# EasyEDA Pro project ProPrj_MambaQuad_2026-02-09.epro, board RC V1
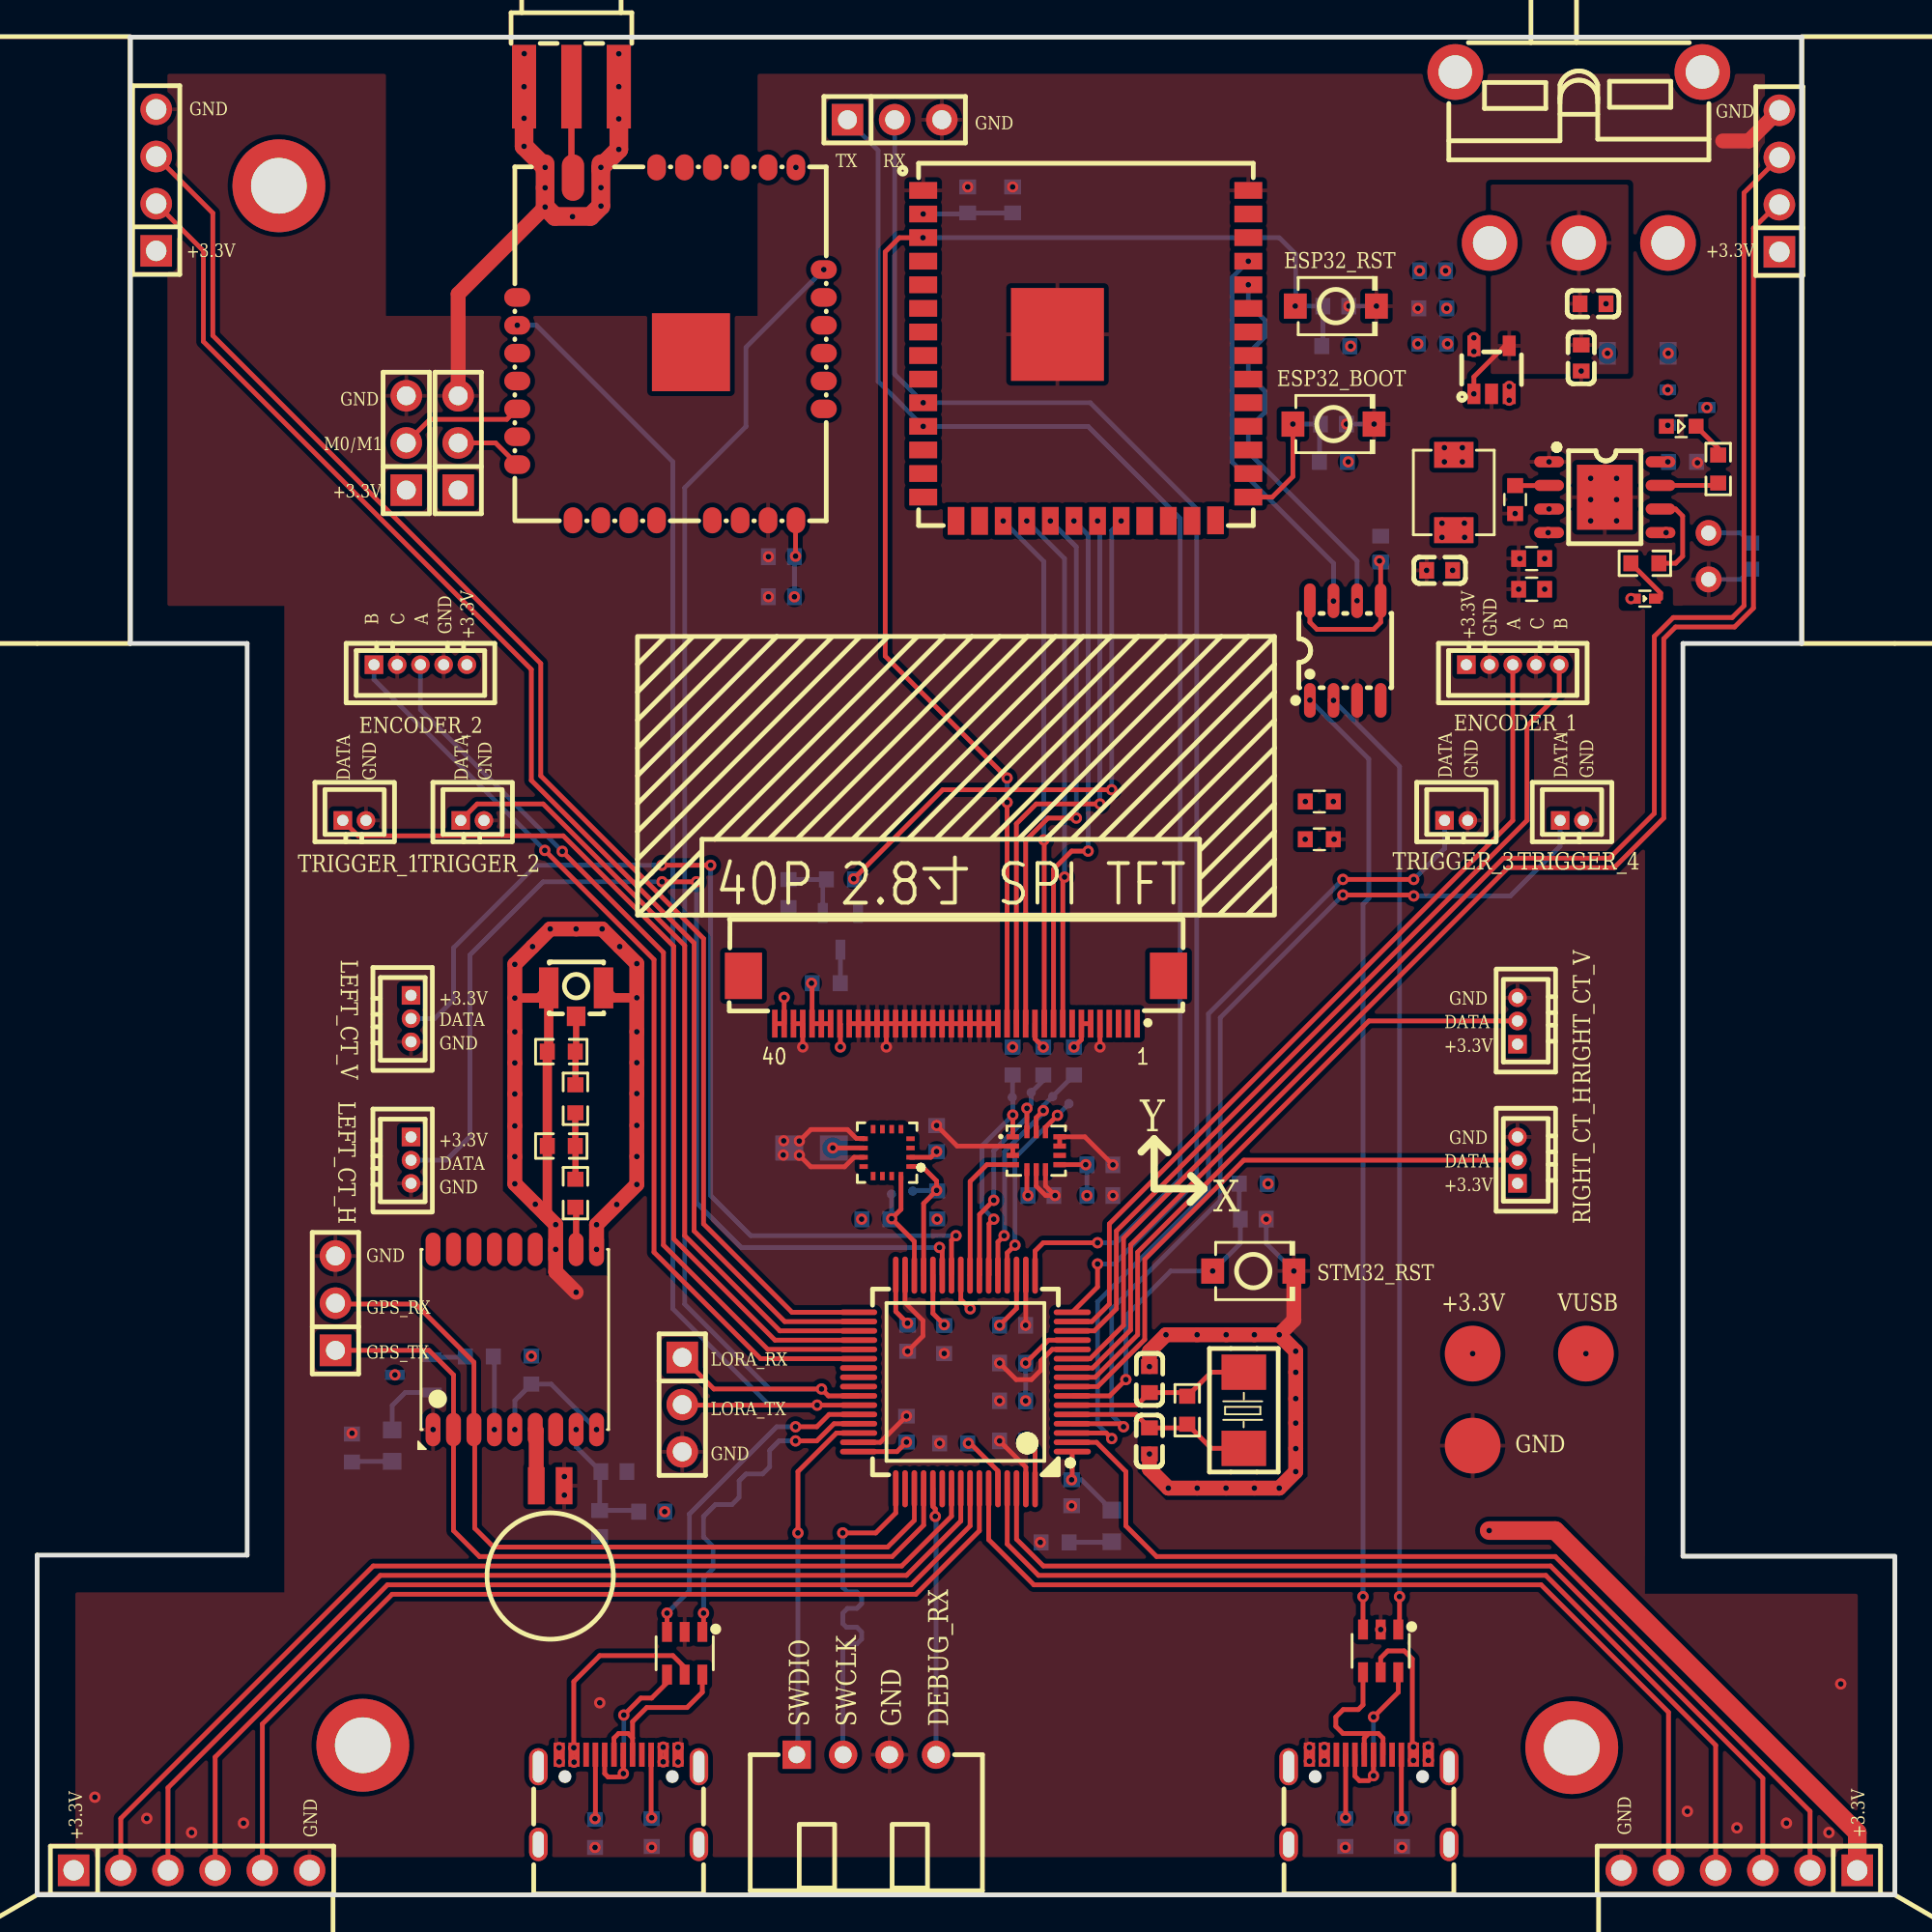
[diagram p10: board, top side]
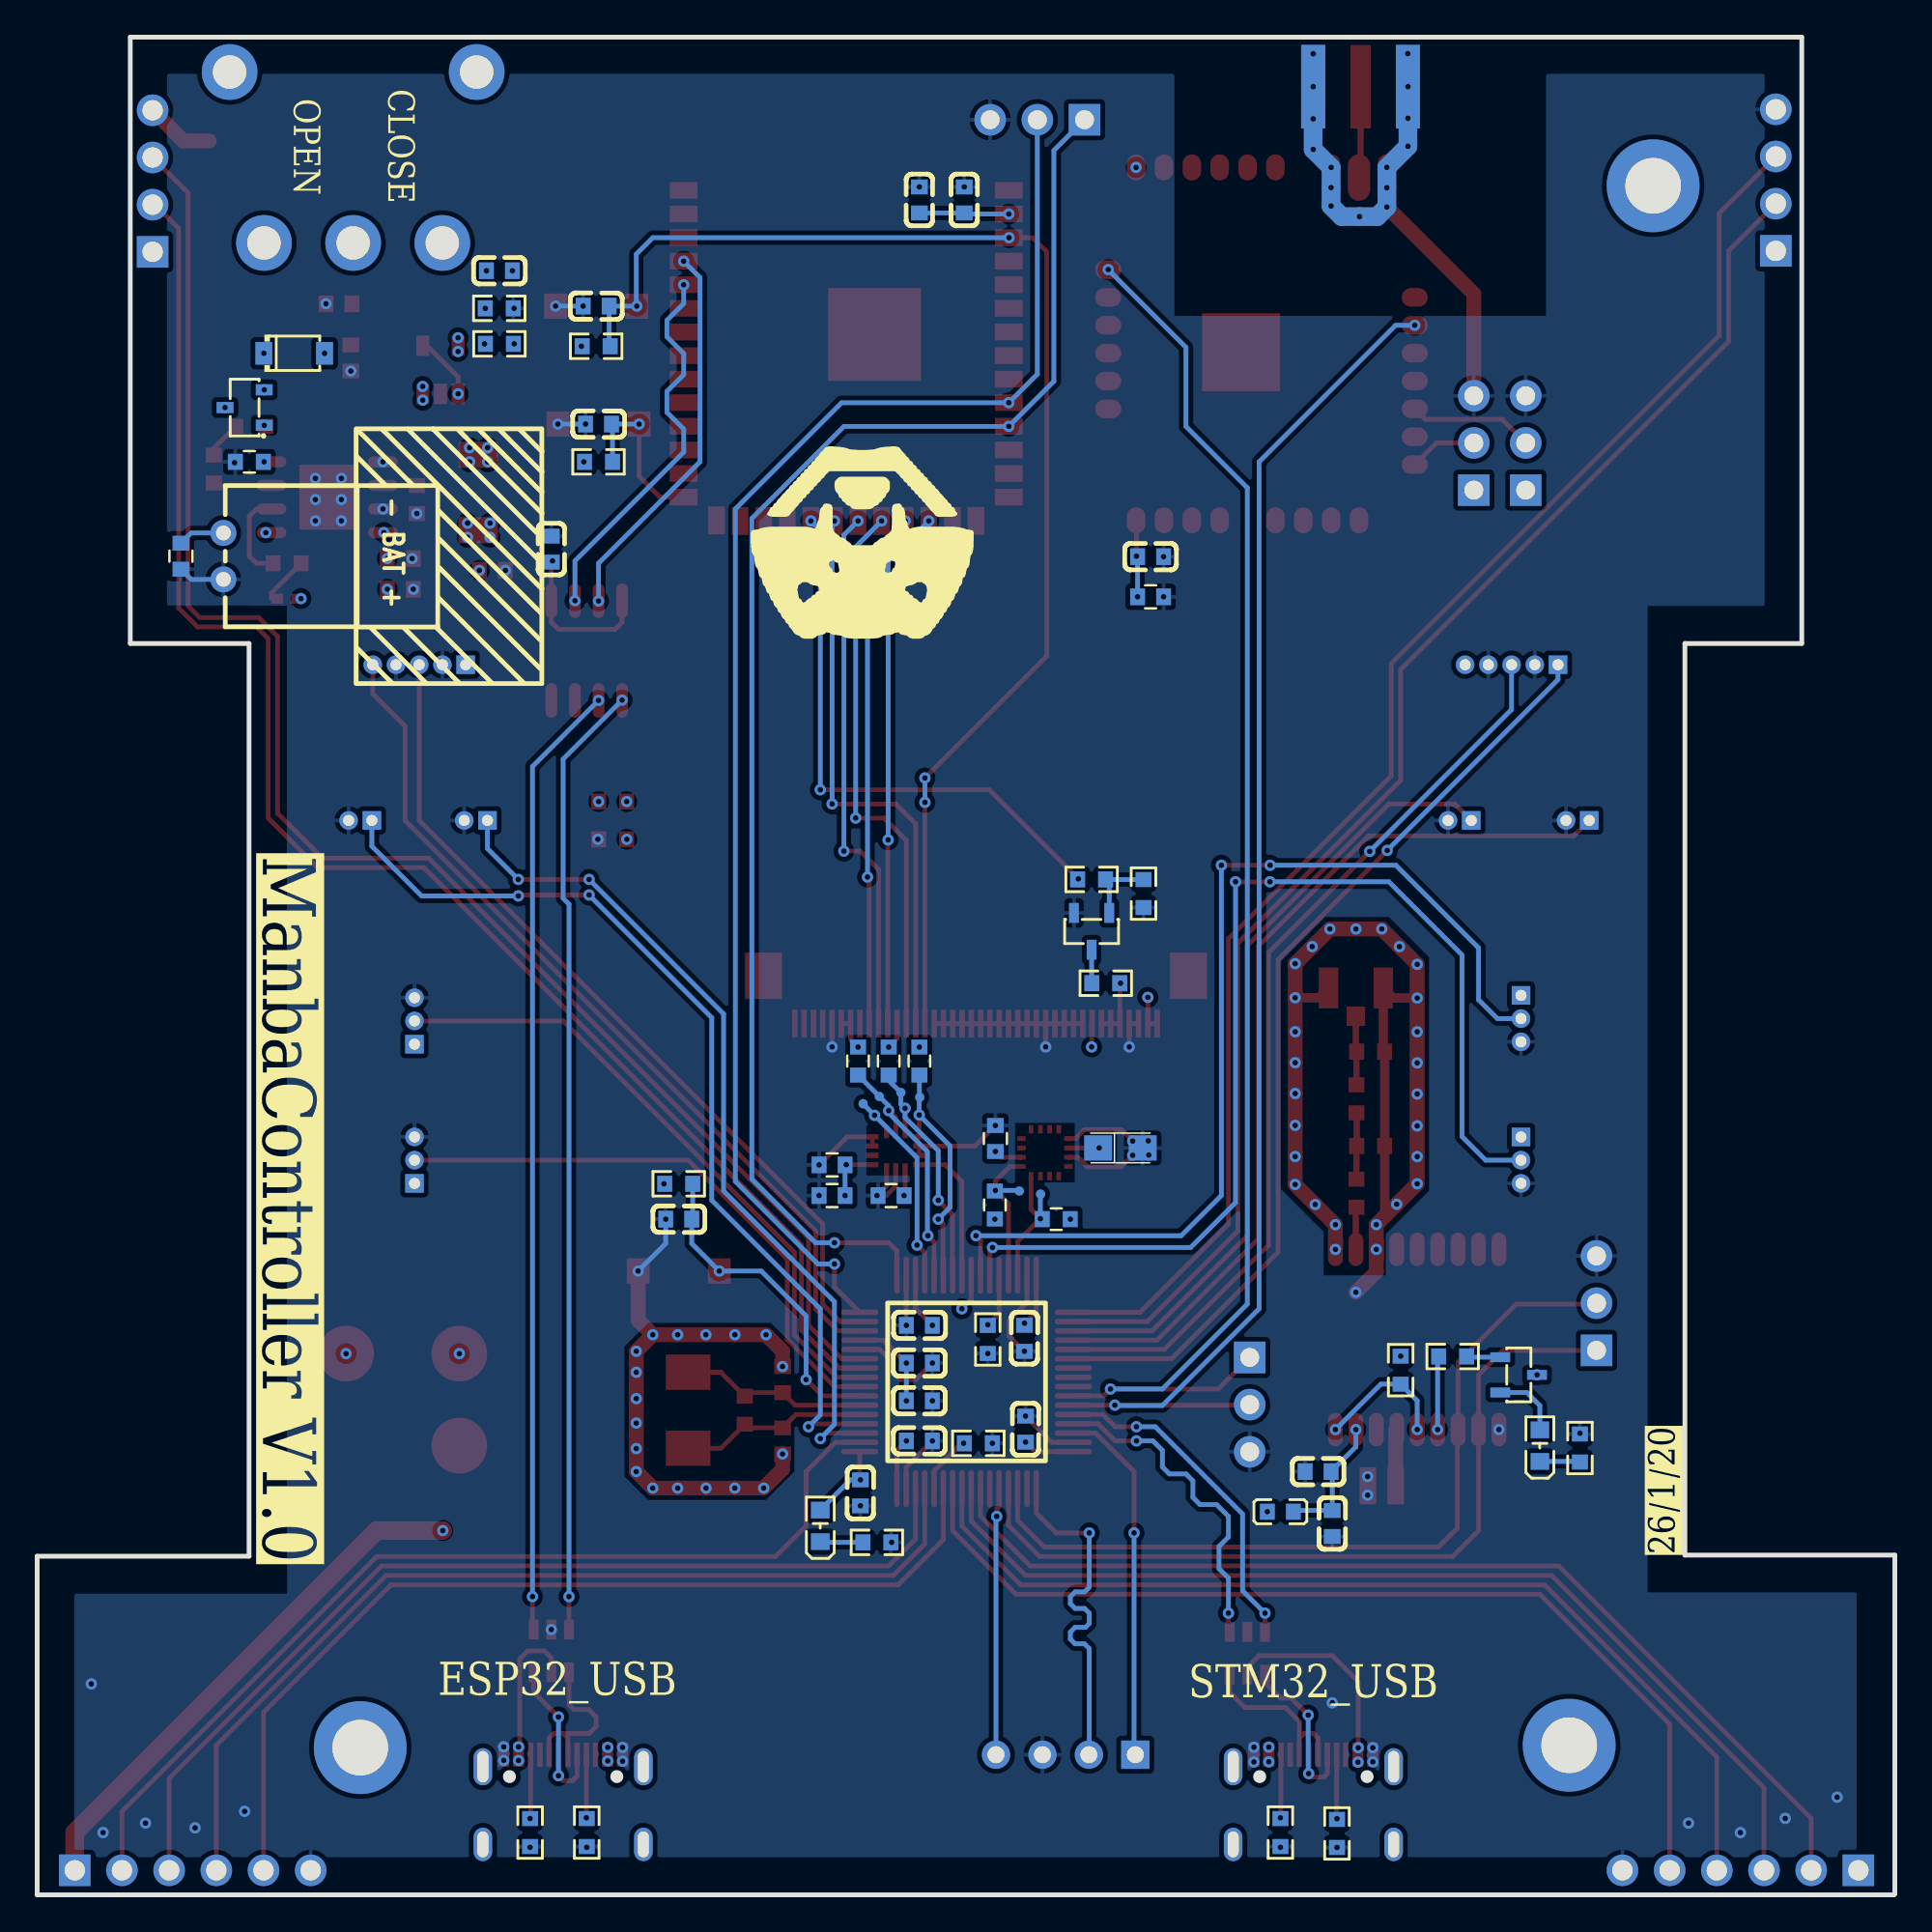
[diagram p11: board, bottom side, seen from below]

Outline 100 x 100 mm; copper layers: Top Layer, Inner1, Inner2, Bottom Layer. Coordinates in mm from the lower left corner of the outline.
Outline path: 0,18.29 11.3,18.29 11.3,67.36 5.01,67.36 5.01,100 94.99,100 94.99,67.36 88.59,67.36 88.59,18.23 100,18.23 100,0 0.05,0 0,0.05 0,18.29
Stack: Top Layer 0.035mm Outer layer thickness 1oz / Dielectric1 0.2104mm 7628 RC49% 8.6mil / Inner1 0.0152mm Inner layer thickness / Dielectric2 1.065mm 1.1mm H/HOZ Copper / Inner2 0.0152mm Inner layer thickness / Dielectric3 0.2104mm 7628 RC49% 8.6mil / Bottom Layer 0.035mm Outer layer thickness 1oz

## Design rules (mm)
net ESP32_RX: DP1
net ESP32_TX: DP1
spacing copperThickness1oz (default): track to track 0.102, other pairs 0.152 to 0.3
spacing copperThickness2oz: track to track 0.203, other pairs 0.152 to 0.3
track width copperThickness1oz (default): min 0.127, default 0.254, max 2.54
track width copperThickness2oz: min 0.203, default 0.254, max 2.54
differential pair differentialPair (default): width min 0.127, default 0.254, max 2.54; gap min 0.152, default 0.152
net VUSB uses copperRegion
net $2N32 uses copperRegion
net BAT+ uses copperRegion
net $2N18 uses copperRegion
net $2N16 uses copperRegion
net +3.3V uses copperRegion
net $2N33 uses copperRegion
net ADC_BAT uses copperRegion
net GND uses copperRegion

## Placement (name value [footprint] x y rotation side)
C1  100nF  [C0603]  80.45 71.93 0 top
C2  10uF  [C0603]  80.45 70.28 0 top
C3  10uF  [C0603]  92.26 72.06 270 bottom
C4  22pF  [C0603_1]  75.12 87.43 180 bottom
C5  10uF  [C0603_1]  75.5 71.3 0 top
C6  10uF  [C0603_1]  83.12 82.73 90 top
C7  10nF  [C0603]  54.03 37.64 180 bottom
C8  100nF  [C0603]  57.21 39.29 180 bottom
C9  2.2uF  [C0603]  57.21 37.64 180 bottom
C10  100nF  [C0603]  48.42 40.72 270 bottom
C11  4.7uF  [CASE-A_3216]  41.69 40.21 180 bottom
C12  100nF  [C0603_1]  72.32 72.44 270 bottom
C13  0.22F  [CAP-TH_DMS3R3224]  27.62 22.02 90 top
C14  10uF  [C0603_1]  31.05 22.78 180 bottom
C15  100nF  [C0603_1]  30.28 19.99 90 bottom
C16  100nF  [C0603_1]  83.75 85.65 180 top
C18  22pF  [C0603]  59.88 27.74 270 top
C19  22pF  [C0603]  59.88 24.44 90 top
C21  100nF  [C0603]  40.06 69.87 0 bottom
C22  4.7uF  [C0603_1]  40.06 72.03 0 bottom
C23  100nF  [C0603_1]  50.1 91.24 90 bottom
C24  4.7uF  [C0603_1]  52.51 91.24 90 bottom
C25  100nF  [C0603]  69.78 79.17 0 bottom
C26  100nF  [C0603]  69.91 85.52 0 bottom
C29  100nF  [C0603]  65.46 36.37 0 bottom
C30  100nF  [C0603]  55.68 21.64 90 bottom
C31  100nF  [C0603]  52.51 26.59 180 bottom
C32  1uF  [C0603]  52.51 28.63 180 bottom
C33  100nF  [C0603]  52.51 30.66 0 bottom
C34  100nF  [C0603]  46.86 29.96 270 bottom
C35  100nF  [C0603]  46.79 25.07 90 bottom
C36  100nF  [C0603]  52.51 24.44 180 bottom
CHRG1  -  [LED0603]  88.45 79.05 180 top
CN1  HC-1.25-3A  [CONN-TH_3P-P1.25_HCTL_HC-1.25-3A]  20.12 47.17 270 top
CN2  HC-1.25-3A  [CONN-TH_3P-P1.25_HCTL_HC-1.25-3A]  20.12 39.55 270 top
CN3  HC-1.25-3A  [CONN-TH_3P-P1.25_HCTL_HC-1.25-3A]  79.69 39.55 90 top
CN4  HC-1.25-3A  [CONN-TH_3P-P1.25_HCTL_HC-1.25-3A]  79.69 47.04 90 top
CN5  HC-1.25-5A  [CONN-TH_5P-P1.25_HCTL_HC-1.25-5A]  20.63 66.22 0 top
CN6  HC-1.25-5A  [CONN-TH_5P-P1.25_HCTL_HC-1.25-5A]  79.43 66.22 0 top
CN7  ATGM336H-6N-74  [COMM-SMD_18P-L10.1-W9.7-P1.1-TL_L76-LB]  25.71 29.9 90 top
CN8  WAFER-XH254WZ-2AL  [CONN-TH_2P-P2.50_WAFER-XH254WZ-2AL]  89.97 72.06 90 bottom
CN10  HC-1.25-2A  [CONN-TH_2P-P1.25_HCTL_HC-1.25-2A]  23.43 57.84 0 top
CN11  HC-1.25-2A  [CONN-TH_2P-P1.25_HCTL_HC-1.25-2A]  76.39 57.84 0 top
CN12  HC-1.25-2A  [CONN-TH_2P-P1.25_HCTL_HC-1.25-2A]  82.61 57.84 0 top
CN13  HC-1.25-2A  [CONN-TH_2P-P1.25_HCTL_HC-1.25-2A]  17.08 57.84 0 top
D1  USBLC6-2SC6  [SOT-23-6_L2.9-W1.6-P0.95-LS2.8-BL]  34.86 13 180 top
D2  USBLC6-2SC6  [SOT-23-6_L2.9-W1.6-P0.95-LS2.8-BL]  72.32 13.13 180 top
D3  1N5819W S4  [SOD-123_L2.7-W1.6-LS3.7-RD]  86.16 82.98 180 bottom
FPC1  FPC-05F-40PH20  [FPC-SMD_40P-P0.50_FPC-05F-40PH20]  49.46 48.18 180 top
FULL1  -  [LED0402]  86.55 69.77 180 top
H1  PZ254V-11-04P  [HDR-TH_4P-P2.54-V-M]  6.41 92.31 90 top
H2  PZ254V-11-04P  [HDR-TH_4P-P2.54-V-M]  93.78 92.25 90 top
H3  PZ254V-11-06P  [HDR-TH_6P-P2.54-V-M]  91.63 1.32 180 top
H4  PZ254V-11-06P  [HDR-TH_6P-P2.54-V-M]  8.31 1.32 0 top
H5  PZ254V-11-03P  [HDR-TH_3P-P2.54-V-M_PZ254V-11-03P]  46.16 95.56 0 top
H6  PZ254V-11-03P  [HDR-TH_3P-P2.54-V-M_PZ254V-11-03P]  19.87 78.16 90 top
H7  PZ254V-11-03P  [HDR-TH_3P-P2.54-V-M_PZ254V-11-03P]  22.66 78.16 90 top
H8  PZ254V-11-03P  [HDR-TH_3P-P2.54-V-M_PZ254V-11-03P]  34.73 26.39 270 top
H9  PZ254V-11-03P  [HDR-TH_3P-P2.54-V-M_PZ254V-11-03P]  16.06 31.85 90 top
ICM42688P1  ICM-42688-P  [LGA-14_L3.0-W2.5-P0.50-TL]  53.78 40.06 0 top
L1  1.5uH  [IND-SMD_L4.4-W4.2]  76.26 75.49 270 top
L2  BLM18PG121SN1D  [L0603]  33.08 20.62 180 bottom
NOREF  -  [Pad_e2269]  77.27 24.18 0 top
NOREF#2  -  [Pad_e1508]  17.53 8.05 0 top
NOREF#3  -  [Pad_e1511]  82.61 7.93 0 top
NOREF#4  -  [Pad_e940]  54.92 84 0 top
NOREF#5  -  [Pad_e1500]  13.01 92 0 top
NOREF#6  -  [Pad_e2267]  77.27 29.13 0 top
NOREF#7  -  [Pad_e2268]  83.37 29.13 0 top
Q1  S8050  [SOT-23-3_L2.9-W1.3-P1.90-LS2.3-BR]  43.24 51.87 90 bottom
Q2  S8050  [SOT-23-3_L2.9-W1.3-P1.90-LS2.3-BR]  20.25 27.99 0 bottom
Q4  AO3401  [SOT-23-3_L2.9-W1.4-P1.90-LS2.6-BR]  88.83 80.06 180 bottom
QMC5883P1  QMC5883P  [LGA-16_L3.0-W3.0-P0.50-BL_SQ]  45.75 39.95 90 top
R1  1.2K  [R0603]  79.56 75.11 90 top
R2  100kΩ  [R0603]  75.12 83.49 180 bottom
R3  22.1kΩ  [R0603]  75.12 85.4 0 bottom
R4  OPT. PU  [R0603]  52.51 44.88 270 bottom
R5  OPT. PU  [R0603]  54.16 44.88 270 bottom
R6  OPT. PU  [R0603]  55.81 44.88 270 bottom
R7  4.7K  [R0603]  45.14 36.37 180 bottom
R8  4.7K  [R0603]  48.45 37.14 270 bottom
R9  10kΩ  [R0603]  33.08 3.35 270 bottom
R10  1MΩ  [R0603]  61.91 26.09 270 top
R11  5.1kΩ  [R0603]  30.03 3.31 270 bottom
R12  10kΩ  [R0603]  73.46 3.35 270 bottom
R13  470mΩ  [R0603]  42.48 49.07 180 bottom
R14  1kΩ  [R0603]  43.24 54.66 180 bottom
R15  10kΩ  [R0603]  40.44 53.9 90 bottom
R16  10kΩ  [R0603]  69.78 77.14 180 bottom
R17  10kΩ  [R0603]  69.91 83.36 180 bottom
R18  5.1kΩ  [R0603]  70.42 3.35 270 bottom
R19  0Ω  [R0603]  28.98 42.85 90 top
R20  0Ω  [R0603]  28.22 40.31 0 top
R21  10kΩ  [R0603]  65.46 38.28 180 bottom
R22  10kΩ  [R0603]  49.33 24.31 180 bottom
R23  10kΩ  [R0603]  48.83 29.9 90 bottom
R24  4.7kΩ  [R0603]  54.8 18.97 180 bottom
R25  0Ω  [R0603]  28.22 45.39 0 top
R26  10kΩ  [R0603]  90.49 76.75 90 top
R27  10kΩ  [R0603]  86.55 71.68 180 top
R28  0Ω  [R0603]  26.6 28.25 90 bottom
R29  0Ω  [R0603]  28.98 37.77 90 top
R30  4.7kΩ  [R0603]  16.95 24.05 270 bottom
R31  1kΩ  [R0603]  23.8 28.98 180 bottom
R32  51K  [R0603]  69.02 58.85 0 top
R33  100K  [R0603]  69.02 56.82 180 top
R35  50K  [R0603]  88.58 77.14 180 bottom
RF1  SMA-KE-P  [SMA-TH_SMA-KE-P]  28.76 97.33 180 top
SW1  SS-12D11G5R  [SW-TH_SS-12D11G5R]  82.99 93.52 0 top
SW2  TS-1088-AR02016  [SW-SMD_L3.9-W3.0-P4.45]  69.78 79.17 0 top
SW3  TS-1088-AR02016  [SW-SMD_L3.9-W3.0-P4.45]  69.91 85.52 0 top
SW4  TS-1088-AR02016  [SW-SMD_L3.9-W3.0-P4.45]  65.46 33.58 0 top
TP1  -  [Test-Point-0.5mm]  52.49 42.93 180 bottom
TP2  -  [Test-Point-0.5mm]  53.51 43.19 180 bottom
TP3  -  [Test-Point-0.5mm]  54.67 42.98 180 bottom
TP4  -  [Test-Point-0.5mm]  55.54 42.58 180 bottom
TP5  -  [Test-Point-0.5mm]  47.13 37.89 270 bottom
TP6  -  [Test-Point-0.5mm]  45.99 37.72 270 bottom
TP4056X1  TP4056X-42-ESOP8  [SOP-8_L4.9-W3.9-P1.27-LS6.0-TL-EP]  84.39 75.23 0 top
U1  ESP32-S3-WROOM-1U-N16R8  [WIRELM-SMD_ESP32-S3-WROOM-1U]  56.45 82.86 0 top
U2  SY8089A1AAC  [TSOT-23-5_L2.9-W1.6-P0.95-LS2.8-BR]  78.29 82.09 270 top
U3  CH340N  [SOP-8_L4.9-W3.9-P1.27-LS6.0-BL_1]  70.42 66.98 0 top
U4  3GHz  [ANT-SMD_3P-L3.0-W2.6]  29.01 48.06 180 top
U5  BX-XH2.54-4PWZ  [CONN-TH_4P-P2.50_BX-XH2.54-4PWZ]  44.64 7.54 0 top
U6  DX-LR01-433T22S  [WIRELM-SMD_DX-LR01-433T22S]  34.09 83.49 0 top
U7  STM32F103RCT6  [LQFP-64_L10.0-W10.0-P0.50-LS12.0-BL]  49.97 27.61 90 top
U8  YLED0603G  [LED0603-FD]  57.84 19.86 270 bottom
U9  YLED0603G  [LED0603-FD]  19.11 24.18 270 bottom
USB1  typec  [USB-C-SMD_KH-TYPE-C-16P]  31.3 5.13 0 top
USB2  typec  [USB-C-SMD_KH-TYPE-C-16P]  71.69 5.13 0 top
X2  8MHz  [CRYSTAL-SMD_L5.0-W3.2]  64.96 26.09 270 top

## Footprints (pads in the part's own frame, mm; a bottom-side part is the same pattern mirrored in y, then rotated)
ANT-SMD_3P-L3.0-W2.6
  rect 1x1.05 smd: 1(0,0.762)
  rect 1.05x2.2 smd: 2(-1.475,-0.762) 3(1.475,-0.762)
C0603
  rect 0.8x0.9 smd: 1(-0.7,0) 2(0.7,0)
C0603_1
  rect 0.8x0.9 smd: 1(-0.7,0) 2(0.7,0)
CAP-TH_DMS3R3224
  rect 2x0.9 smd: 1(-0.002,0.75) 2(0.002,-0.75)
CASE-A_3216
  rect 1.5x1.359 smd: 1(-1.2,0) 2(1.2,0)
COMM-SMD_18P-L10.1-W9.7-P1.1-TL_L76-LB
  custom 1.8x0.8 smd: 1(-4.85,4.4) 2(-4.85,3.3) 3(-4.85,2.2) 4(-4.85,1.1) 5(-4.85,0) 6(-4.85,-1.1) 7(-4.85,-2.2) 8(-4.85,-3.3) 9(-4.85,-4.4) 10(4.85,-4.4) 11(4.85,-3.3) 12(4.85,-2.2) 13(4.85,-1.1) 14(4.85,0) 15(4.85,1.1) 16(4.85,2.2) 17(4.85,3.3) 18(4.85,4.4)
CONN-TH_2P-P1.25_HCTL_HC-1.25-2A
  rect 1x1 hole 0.6: 1(-0.625,0)
  round 1 hole 0.6: 2(0.625,0)
CONN-TH_2P-P2.50_WAFER-XH254WZ-2AL
  round 1.4 hole 0.8: 1(-1.25,0) 2(1.25,0)
CONN-TH_3P-P1.25_HCTL_HC-1.25-3A
  rect 1x1 hole 0.6: 1(-1.25,0)
  round 1 hole 0.6: 2(0,0) 3(1.25,0)
CONN-TH_4P-P2.50_BX-XH2.54-4PWZ
  rect 1.524x1.524 hole 0.914: 1(-3.75,0)
  round 1.524 hole 0.914: 2(-1.25,0) 3(1.25,0) 4(3.75,0)
CONN-TH_5P-P1.25_HCTL_HC-1.25-5A
  rect 1x1 hole 0.6: 1(-2.5,0)
  round 1 hole 0.6: 2(-1.25,0) 3(0,0) 4(1.25,0) 5(2.5,0)
CRYSTAL-SMD_L5.0-W3.2
  rect 1.9x2.4 smd: 1(-2.05,0) 2(2.05,0)
FPC-SMD_40P-P0.50_FPC-05F-40PH20
  rect 0.3x1.5 smd: 1(-9.75,1.288) 2(-9.25,1.288) 3(-8.75,1.288) 4(-8.25,1.288) 5(-7.75,1.288) 6(-7.25,1.288) 7(-6.75,1.288) 8(-6.25,1.288) 9(-5.75,1.288) 10(-5.25,1.288) 11(-4.75,1.288) 12(-4.25,1.288) 13(-3.75,1.288) 14(-3.25,1.288) 15(-2.75,1.288) 16(-2.25,1.288) 17(-1.75,1.288) 18(-1.25,1.288) 19(-0.75,1.288) 20(-0.25,1.288) 21(0.25,1.288) 22(0.75,1.288) 23(1.25,1.288) 24(1.75,1.288) 25(2.25,1.288) 26(2.75,1.288) 27(3.25,1.288) 28(3.75,1.288) 29(4.25,1.288) 30(4.75,1.288) 31(5.25,1.288) 32(5.75,1.288) 33(6.25,1.288) 34(6.75,1.288) 35(7.25,1.288) 36(7.75,1.288) 37(8.25,1.288) 38(8.75,1.288) 39(9.25,1.288) 40(9.75,1.288)
  rect 2x2.5 smd: 41(11.44,-1.288) 42(-11.44,-1.288)
HDR-TH_3P-P2.54-V-M_PZ254V-11-03P
  rect 1.7x1.7 hole 1.02: 1(-2.54,0)
  round 1.7 hole 1.02: 2(0,0) 3(2.54,0)
HDR-TH_4P-P2.54-V-M
  rect 1.7x1.7 hole 1.1: 1(-3.81,0)
  round 1.7 hole 1.1: 2(-1.27,0) 3(1.27,0) 4(3.81,0)
HDR-TH_6P-P2.54-V-M
  rect 1.7x1.7 hole 1.1: 1(-6.35,0)
  round 1.7 hole 1.1: 2(-3.81,0) 3(-1.27,0) 4(1.27,0) 5(3.81,0) 6(6.35,0)
IND-SMD_L4.4-W4.2
  rect 1.4x2.12 smd: 1(2.028,0) 2(-2.028,0)
L0603
  rect 0.8x0.864 smd: 1(-0.7,0) 2(0.7,0)
LED0402
  rect 0.637x0.541 smd: 1(-0.538,0) 2(0.538,0)
LED0603
  rect 0.8x0.8 smd: 1(-0.851,-0.01) 2(0.75,-0.005)
LED0603-FD
  rect 0.9x1 smd: 1(-0.85,0) 2(0.85,0)
LGA-14_L3.0-W2.5-P0.50-TL
  rect 0.675x0.28 smd: 1(-1.262,0.75) 2(-1.262,0.25) 3(-1.262,-0.25) 4(-1.262,-0.75) 8(1.262,-0.75) 9(1.262,-0.25) 10(1.262,0.25) 11(1.262,0.75)
  rect 0.28x0.675 smd: 5(-0.5,-1.012) 6(0,-1.012) 7(0.5,-1.012) 12(0.5,1.012) 13(0,1.012) 14(-0.5,1.012)
LGA-16_L3.0-W3.0-P0.50-BL_SQ
  rect 0.25x0.45 smd: 1(-0.75,-1.263) 2(-0.25,-1.263) 3(0.25,-1.263) 4(0.75,-1.263) 9(0.75,1.263) 10(0.25,1.263) 11(-0.25,1.263) 12(-0.75,1.263)
  rect 0.45x0.25 smd: 5(1.263,-0.75) 6(1.263,-0.25) 7(1.263,0.25) 8(1.263,0.75) 13(-1.263,0.75) 14(-1.263,0.25) 15(-1.263,-0.25) 16(-1.263,-0.75)
LQFP-64_L10.0-W10.0-P0.50-LS12.0-BL
  oval 0.3x2 smd: 1(-3.75,-5.75) 2(-3.25,-5.75) 3(-2.75,-5.75) 4(-2.25,-5.75) 5(-1.75,-5.75) 6(-1.25,-5.75) 7(-0.75,-5.75) 8(-0.25,-5.75) 9(0.25,-5.75) 10(0.75,-5.75) 11(1.25,-5.75) 12(1.75,-5.75) 13(2.25,-5.75) 14(2.75,-5.75) 15(3.25,-5.75) 16(3.75,-5.75) 33(3.75,5.75) 34(3.25,5.75) 35(2.75,5.75) 36(2.25,5.75) 37(1.75,5.75) 38(1.25,5.75) 39(0.75,5.75) 40(0.25,5.75) 41(-0.25,5.75) 42(-0.75,5.75) 43(-1.25,5.75) 44(-1.75,5.75) 45(-2.25,5.75) 46(-2.75,5.75) 47(-3.25,5.75) 48(-3.75,5.75)
  oval 2x0.3 smd: 17(5.75,-3.75) 18(5.75,-3.25) 19(5.75,-2.75) 20(5.75,-2.25) 21(5.75,-1.75) 22(5.75,-1.25) 23(5.75,-0.75) 24(5.75,-0.25) 25(5.75,0.25) 26(5.75,0.75) 27(5.75,1.25) 28(5.75,1.75) 29(5.75,2.25) 30(5.75,2.75) 31(5.75,3.25) 32(5.75,3.75) 49(-5.75,3.75) 50(-5.75,3.25) 51(-5.75,2.75) 52(-5.75,2.25) 53(-5.75,1.75) 54(-5.75,1.25) 55(-5.75,0.75) 56(-5.75,0.25) 57(-5.75,-0.25) 58(-5.75,-0.75) 59(-5.75,-1.25) 60(-5.75,-1.75) 61(-5.75,-2.25) 62(-5.75,-2.75) 63(-5.75,-3.25) 64(-5.75,-3.75)
Pad_e940
  rect 5x5 smd: 49(0,0)
Pad_e1500
  round 5 hole 3: 1(0,0)
Pad_e1508
  round 5 hole 3: 1(0,0)
Pad_e1511
  round 5 hole 3: 1(0,0)
Pad_e2267
  round 3 smd: 1(0,0)
Pad_e2268
  round 3 smd: 1(0,0)
Pad_e2269
  round 3 smd: 1(0,0)
R0603
  rect 0.806x0.864 smd: 1(-0.753,0) 2(0.753,0)
SMA-TH_SMA-KE-P
  rect 1.3x4.5 smd: 1(2.55,0) 2(-2.55,0)
  rect 1.3x4.5 smd far side: 3(2.55,0) 4(-2.55,0)
  rect 1.1x4.5 smd: 5(0,0)
SOD-123_L2.7-W1.6-LS3.7-RD
  rect 0.91x1.22 smd: 1(-1.635,0) 2(1.635,0)
SOP-8_L4.9-W3.9-P1.27-LS6.0-BL_1
  oval 0.63x1.865 smd: 1(-1.905,-2.683) 2(-0.635,-2.683) 3(0.635,-2.683) 4(1.905,-2.683) 5(1.905,2.683) 6(0.635,2.683) 7(-0.635,2.683) 8(-1.905,2.683)
SOP-8_L4.9-W3.9-P1.27-LS6.0-TL-EP
  oval 1.6x0.6 smd: 1(-3,1.905) 2(-3,0.635) 3(-3,-0.635) 4(-3,-1.905) 5(3,-1.905) 6(3,-0.635) 7(3,0.635) 8(3,1.905)
  rect 3x3.5 smd: 9(0,0)
SOT-23-3_L2.9-W1.3-P1.90-LS2.3-BR
  rect 1.07x0.532 smd: 1(0.99,-0.95) 2(0.99,0.95) 3(-0.99,0)
SOT-23-3_L2.9-W1.4-P1.90-LS2.6-BR
  rect 0.91x0.6 smd: 1(1.055,-0.955) 2(1.055,0.955) 3(-1.055,0)
SOT-23-6_L2.9-W1.6-P0.95-LS2.8-BL
  rect 0.532x1.072 smd: 1(-0.95,-1.149) 2(0,-1.149) 3(0.95,-1.149) 4(0.95,1.149) 5(0,1.149) 6(-0.95,1.149)
SW-SMD_L3.9-W3.0-P4.45
  rect 1.23x1.36 smd: 1(-2.185,0) 2(2.185,0)
SW-TH_SS-12D11G5R
  round 3 hole 1.8: 1(-4.8,-4.6) 2(0,-4.6) 3(4.8,-4.6) 4(6.65,4.6) 5(-6.65,4.6)
Test-Point-0.5mm
  round 0.5 smd: 1(0,0)
TSOT-23-5_L2.9-W1.6-P0.95-LS2.8-BR
  rect 1.1x0.7 smd: 1(1.294,-0.951) 2(1.294,-0.001) 3(1.294,0.951) 4(-1.294,0.951) 5(-1.294,-0.949)
USB-C-SMD_KH-TYPE-C-16P
  oval 1x2 hole 0.6x1.7: 1(-4.32,1.765) 2(4.32,1.765)
  oval 1x1.8 hole 0.6x1.4: 3(-4.32,-2.415) 4(4.32,-2.415)
  rect 0.3x1.3 smd: A1(-3.35,2.415) A4(-2.55,2.415) A5(-1.25,2.415) A6(-0.25,2.415) A7(0.25,2.415) A8(1.25,2.415) A9(2.55,2.415) A12(3.35,2.415) B1(3.05,2.415) B4(2.25,2.415) B5(1.75,2.415) B6(0.75,2.415) B7(-0.75,2.415) B8(-1.75,2.415) B9(-2.25,2.415) B12(-3.05,2.415)
WIRELM-SMD_DX-LR01-433T22S
  oval 1.4x1 smd: 1(-8.25,2.5) 2(-8.25,1) 3(-8.25,-0.5) 4(-8.25,-2) 5(-8.25,-3.5) 6(-8.25,-5) 7(-8.25,-6.5) 16(8.25,-3.5) 17(8.25,-2) 18(8.25,-0.5) 19(8.25,1) 20(8.25,2.5) 21(8.25,4)
  oval 1x1.4 smd: 8(-5.25,-9.5) 9(-3.75,-9.5) 10(-2.25,-9.5) 11(-0.75,-9.5) 12(2.25,-9.5) 13(3.75,-9.5) 14(5.25,-9.5) 15(6.75,-9.5) 22(6.75,9.5) 23(5.25,9.5) 24(3.75,9.5) 25(2.25,9.5) 26(0.75,9.5) 27(-0.75,9.5) 28(-3.75,9.5) 30(-6.75,9.5)
  oval 1.2x2.5 smd: 29(-5.25,8.95)
  rect 4.2x4.2 smd: 31(1.1,-0.45)
WIRELM-SMD_ESP32-S3-WROOM-1U
  rect 1.5x0.9 smd: 1(-8.75,8.895) 2(-8.75,7.625) 3(-8.75,6.355) 4(-8.75,5.085) 5(-8.75,3.815) 6(-8.75,2.545) 7(-8.75,1.275) 8(-8.75,0.005) 9(-8.75,-1.265) 10(-8.75,-2.535) 11(-8.75,-3.805) 12(-8.75,-5.075) 13(-8.75,-6.345) 14(-8.75,-7.615) 27(8.75,-7.615) 28(8.75,-6.345) 29(8.75,-5.075) 30(8.75,-3.805) 31(8.75,-2.535) 32(8.75,-1.265) 33(8.75,0.005) 34(8.75,1.275) 35(8.75,2.545) 36(8.75,3.815) 37(8.75,5.085) 38(8.75,6.355) 39(8.75,7.625) 40(8.75,8.895)
  rect 0.9x1.5 smd: 15(-6.985,-8.895) 16(-5.715,-8.895) 17(-4.445,-8.895) 18(-3.175,-8.895) 19(-1.905,-8.895) 20(-0.635,-8.895) 21(0.635,-8.895) 22(1.905,-8.895) 23(3.175,-8.895) 24(4.445,-8.895) 25(5.715,-8.895) 26(6.985,-8.865)
  rect 0.9x0.9 smd: 41(-2.9,2.575) 41(-2.9,1.175) 41(-2.9,-0.225) 41(-1.5,2.575) 41(-1.5,1.175) 41(-1.5,-0.225) 41(-0.1,2.575) 41(-0.1,1.175) 41(-0.1,-0.225)

## Nets
As in the schematic, except:
+3.3V: C4.2 C5.2 C7.2 C8.2 C9.2 C10.2 C12.2 C21.2 C22.2 C23.1 C24.1 C30.2 C31.1 C32.1 C33.1 C34.1 C35.1 C36.1 CN1.1 CN2.1 CN3.1 CN4.1 CN5.5 CN6.1 FPC1.6 FPC1.7 FPC1.12 FPC1.33 FPC1.39 FPC1.40 H1.1 H2.1 H3.1 H4.1 H6.1 H7.1 ICM42688P1.5 ICM42688P1.8 L1.1 L2.1 NOREF#6.1 Q2.3 QMC5883P1.2 R2.2 R4.1 R5.1 R6.1 R7.2 R8.2 R16.1 R17.1 R21.1 R28.2 U1.2 U3.5 U3.8 U6.15 U6.22 U7.1 U7.13 U7.19 U7.32 U7.48 U7.64 U8.1
GND: C1.1 C2.1 C3.2 C5.1 C6.1 C7.1 C8.1 C9.1 C10.1 C11.2 C12.1 C13.2 C14.1 C15.1 C16.1 C18.1 C19.1 C21.1 C22.1 C23.2 C24.2 C25.2 C26.2 C29.2 C30.1 C31.2 C32.2 C33.2 C34.2 C35.2 C36.2 CN1.3 CN2.3 CN3.3 CN4.3 CN5.2 CN5.4 CN6.2 CN6.4 CN7.1 CN7.10 CN7.12 CN8.1 CN10.2 CN11.2 CN12.2 CN13.2 D1.2 D2.2 FPC1.5 FPC1.16 FPC1.17 FPC1.18 FPC1.19 FPC1.20 FPC1.21 FPC1.22 FPC1.23 FPC1.24 FPC1.25 FPC1.26 FPC1.27 FPC1.28 FPC1.29 FPC1.30 FPC1.31 FPC1.32 FPC1.37 FPC1.38 H1.4 H2.4 H3.6 H4.6 H5.3 H6.3 H7.3 H8.3 H9.3 ICM42688P1.2 ICM42688P1.3 ICM42688P1.6 ICM42688P1.7 ICM42688P1.10 ICM42688P1.11 NOREF.1 NOREF#4.49 Q1.2 QMC5883P1.9 QMC5883P1.11 R1.1 R3.1 R9.2 R11.2 R12.2 R15.1 R18.2 R20.1 R22.2 R23.1 R24.2 R25.1 R30.1 R33.1 R35.1 RF1.1 RF1.2 RF1.3 RF1.4 SW2.2 SW3.2 SW4.2 TP4056X1.1 TP4056X1.3 TP4056X1.9 U1.1 U1.40 U1.41 U2.2 U3.3 U4.2 U4.3 U5.3 U6.14 U6.28 U6.30 U7.12 U7.18 U7.31 U7.47 U7.63 USB1.A1 USB1.A12 USB1.B1 USB1.B12 USB2.A1 USB2.A12 USB2.B1 USB2.B12
VUSB: C1.2 C2.2 CHRG1.2 D1.5 D2.5 D3.2 FULL1.1 NOREF#7.1 Q4.1 R35.2 TP4056X1.4 TP4056X1.8 USB1.A4 USB1.A9 USB1.B4 USB1.B9 USB2.A4 USB2.A9 USB2.B4 USB2.B9
$2N37: FULL1.2 R27.2

Pads without a net: CN7 7 13 14 15 16 17 18; FPC1 1 2 3 4 8 41 42; ICM42688P1 9; NOREF#2 1; NOREF#3 1; NOREF#5 1; QMC5883P1 3 4 5 6 7 8 12 13 14 15; SW1 1 4 5; U1 4 5 6 7 8 9 12 13 14 15 16 23 24 25 26 28 29 30 31 32 33 34 35 38 39; U3 4; U6 1 3 4 6 8 9 10 11 12 13 16 17 18 19 20 23 24 25 26 27 31; U7 39 40 41 50; USB1 1 2 3 4 A8 B8; USB2 1 2 3 4 A8 B8

## Via types
v1: diameter 0.61, hole 0.305, Top Layer to Bottom Layer, 293 vias

## Routing (per net, layer and track width the routed paths; a pad name or vN(x,y) marks a point on that pad's centre or on a via; arc(x,y) is an arc through that point)
+3.3V: length 84.7
  Top Layer w0.254: v1(48.42,40.02) 48.11,39.7 QMC5883P1.2 ; v1(55.81,45.64) 56.21,46.04 FPC1.7 FPC1.6 ; FPC1.40 FPC1.39 v1(40.21,48.31) ; v1(53.21,24.44) 53.72,23.93 U7.64 ; v1(53.21,28.63) 54.44,29.86 U7.13 ; v1(53.33,37.64) 53.28,37.7 ICM42688P1.5 ; v1(43.24,45.64) 43.24,46.87 FPC1.33 ; v1(51.81,30.66) 52.72,31.57 U7.19 ; v1(46.85,30.77) 46.22,31.4 U7.32 ; v1(72.26,71.81) C12.2 U3.5 72.32,68.5 71.94,68.12 68.89,68.12 68.51,68.5 U3.8 ; ICM42688P1.8 v1(56.45,39.31) ; v1(54.16,45.64) 53.71,46.08 FPC1.12 ; v1(55.68,22.34) 55.72,22.38 U7.1 ; U6.15 40.83,73.97 v1(40.83,72.06) ; v1(46.79,24.37) 46.28,23.86 U7.48
  Top Layer w1: v1(78.16,19.61) 81.72,19.61 97.98,3.35 H3.1
  Inner1 w1: H2.1 91.88,88.44 ; H4.1 3.11,2.46 3.11,3.99
  Bottom Layer w0.254: v1(56.51,37.64) C8.2 ; v1(47.7,90.48) 50.04,90.48 C23.1 C24.1 ; v1(55.68,22.34) 56.22,22.34 U8.1 ; v1(53.21,26.59) v1(53.21,28.63) ; v1(40.76,69.87) C22.2
  vias: v1(19.26,27.99) v1(26.6,29) v1(33.78,20.62) v1(40.84,92.99) v1(44.38,36.37) v1(48.45,36.37) v1(52.51,45.64) v1(66.26,38.28) v1(70.58,77.14) v1(70.7,83.36) v1(74.32,83.49) v1(74.42,87.43) v1(75.62,73.84) v1(75.62,73.08) v1(76.2,71.3) v1(76.83,73.84) v1(76.84,73.08) v1(77.27,29.13)
GND: length 200.1
  Top Layer w0.254: v1(53.21,30.66) 53.22,30.67 U7.18 ; v1(41.03,40.58) 41.64,41.2 43.62,41.2 44.1,40.72 44.48,40.72 QMC5883P1.9 ; FPC1.16 FPC1.17 FPC1.18 FPC1.19 FPC1.20 FPC1.21 FPC1.22 FPC1.23 FPC1.24 FPC1.25 FPC1.26 FPC1.27 FPC1.28 ; FPC1.5 v1(57.21,45.64) ; FPC1.28 v1(45.71,45.64) ; FPC1.28 FPC1.29 FPC1.30 FPC1.31 FPC1.32 ; ICM42688P1.10 ICM42688P1.11 56.4,40.81 v1(57.91,39.29) ; 27.54,45.47 R25.1 ; ICM42688P1.3 ICM42688P1.2 49.53,40.31 v1(48.42,41.42) ; ICM42688P1.7 54.28,38.16 v1(54.8,37.64) 54.29,37.64 53.78,38.15 ICM42688P1.6 ; v1(46.86,29.26) 47.68,30.09 47.68,30.91 46.72,31.88 U7.31 ; v1(51.81,24.44) 53.22,23.03 U7.63 ; FPC1.38 FPC1.37 v1(41.21,45.64) ; 27.46,36.7 27.38,36.61 ; U7.47 45.38,24.36 v1(46.79,25.77) ; QMC5883P1.11 43.98,39.7 43.47,39.19 41.65,39.19 v1(41.03,39.81) ; U7.12 54.64,29.36 54.03,28.75 54.03,28.25 53.53,27.74 52.7,27.74 v1(51.81,28.63)
  Top Layer w0.5: 27.46,36.7 R20.1 R25.1 ; 27.54,45.47 U4.3 27,48.28 v1(25.71,48.28) ; U4.2 31.02,48.29 v1(32.28,48.29)
  Top Layer w0.8: v1(66.86,30.15) v1(65.52,30.15) v1(64,30.15) v1(62.44,30.15) v1(60.76,30.15) 59.88,29.26 v1(59.88,28.44) ; v1(66.86,30.15) 67.65,30.94 v1(67.65,33.58) ; v1(66.86,30.15) v1(67.75,29.26) v1(67.75,28.13) v1(67.75,26.71) v1(67.75,25.4) v1(67.75,24.02) v1(67.75,22.78) v1(66.86,21.9) v1(65.52,21.9) v1(64,21.9) v1(62.44,21.9) v1(60.89,21.9) 59.88,22.91 v1(59.88,23.74) ; 90.74,94.41 92.13,94.41 H2.4 ; v1(30.11,34.75) v1(30.11,36.07) v1(31.2,37.16) v1(32.28,38.24) v1(32.28,39.74) v1(32.28,41.42) v1(32.28,43.13) v1(32.28,44.8) v1(32.28,46.46) v1(32.28,48.29) v1(32.28,50.13) v1(31.36,51.04) v1(30.41,51.99) v1(29.01,51.99) v1(27.62,51.99) v1(26.67,51.04) v1(25.71,50.09) v1(25.71,48.28) v1(25.71,46.46) v1(25.71,44.78) v1(25.71,43.11) v1(25.71,41.39) v1(25.71,39.74) v1(25.71,38.28) v1(26.81,37.18) v1(27.91,36.08) v1(27.91,34.75) 27.91,33.54 v1(29.01,32.44) ; H7.3 22.66,86.18 v1(27.34,90.86)
  Top Layer w1: v1(31.31,97.33) v1(31.31,95.6) v1(31.31,93.96) v1(30.34,92.99) 30.34,90.92 29.78,90.35 27.87,90.35 27.34,90.88 v1(27.34,91.89) v1(27.34,92.99) v1(26.21,94.12) v1(26.21,95.63) v1(26.21,97.33)
  Bottom Layer w0.254: v1(66.16,36.37) 66.16,35.06 v1(67.65,33.58) ; 30.35,92.99 v1(30.34,92.99) ; C3.2 91.71,70.81 CN8.1 ; v1(70.48,79.17) v1(71.97,79.17) ; v1(70.61,85.52) v1(72.09,85.52)
  Bottom Layer w1: v1(26.21,97.33) v1(26.21,95.63) v1(26.21,94.12) v1(27.34,92.99) v1(27.34,91.89) v1(27.34,90.86) 27.86,90.34 v1(28.82,90.34) 29.78,90.34 v1(30.35,90.91) v1(30.35,91.9) 30.35,92.99 ; v1(30.34,92.99) v1(31.31,93.96) v1(31.31,95.6) v1(31.31,97.33)
  vias: v1(3.11,5.26) v1(5.9,4.12) v1(8.31,3.35) v1(11.11,3.86) v1(16.95,24.85) v1(21.31,25.05) v1(26.22,99.11) v1(28.1,7.92) v1(28.1,7.16) v1(28.38,22.52) v1(28.38,21.51) v1(30.03,2.55) v1(30.28,10.34) v1(31.31,99.1) v1(33.08,2.56) v1(34.5,7.94) v1(34.5,7.15) v1(39.36,72.03) v1(39.36,69.87) v1(40.16,39.83) v1(40.19,40.59) v1(48.58,24.31) v1(48.83,29.14) v1(50.1,91.94) v1(51.81,26.59) v1(52.51,91.94) v1(54,18.97) v1(55.68,20.94) v1(57.91,37.64) v1(68.49,7.94) v1(68.49,7.2) v1(69.81,56.82) v1(70.42,2.56) v1(72.32,14.28) v1(73.46,2.56) v1(74.33,85.4) v1(74.8,71.3) v1(74.89,7.97) v1(74.89,7.24) v1(79.56,74.35) v1(79.75,70.28) v1(79.81,71.93) v1(81.39,77.14) v1(81.39,74.6) v1(83.12,82.03) v1(83.62,76.25) v1(83.62,75.11) v1(83.62,73.97) v1(84.45,85.65) v1(85.02,76.25) v1(85.02,75.11) v1(85.02,73.97) v1(88.83,4.5) v1(89.37,77.09) v1(91.5,3.61) v1(94.17,3.86) v1(96.45,3.35) v1(97.09,11.35)
1PPS: length 4
  Bottom Layer w0.254: v1(24.61,25.05) 24.61,28.92 R31.1
ADC_BAT: length 2
  Top Layer w0.254: v1(50.22,31.55) 49.72,32.05 U7.25
  vias: v1(68.27,58.85) v1(68.26,56.82)
BAT+: length 2.5
  Bottom Layer w0.254: C3.1 91.71,73.31 CN8.2
  vias: v1(87.69,73.33) v1(89.89,80.06)
CHRG: length 3.2
  Top Layer w0.254: R26.1 90.36,75.87 TP4056X1.7
DEBUG_RX: length 14.4
  Top Layer w0.254: U7.53 48.22,20.9 48.35,20.78 v1(48.35,20.37)
  Bottom Layer w0.254: U5.4 48.39,20.33 v1(48.35,20.37)
ENCODER_1_A: length 45.8
  Top Layer w0.254: CN6.3 79.43,57.84 57.72,36.12 57.72,31.8 56.78,30.86 U7.15
ENCODER_1_B: length 47.4
  Top Layer w0.254: CN6.5 81.93,64.65 80.2,62.92 80.2,57.84 58.1,35.74 58.1,31.55 56.91,30.36 U7.14
ENCODER_2_A: length 49.5
  Top Layer w0.254: U7.37 39.33,29.36 33.71,34.98 33.71,50.72 v1(28.27,56.17)
  Bottom Layer w0.254: CN5.3 20.63,63.81 v1(28.27,56.17)
ENCODER_2_B: length 51.3
  Top Layer w0.254: U7.38 38.94,28.86 33.21,34.59 33.21,50.34 v1(27.33,56.22)
  Bottom Layer w0.254: v1(27.33,56.22) 18.13,65.42 CN5.1
ESP32_BOOT: length 9.2
  Top Layer w0.254: v1(67.6,79.17) 67.6,76.35 66.48,75.24 U1.27
  Bottom Layer w0.254: R16.2 69.03,79.12 C25.1 v1(67.6,79.17)
ESP32_RESET: length 73.5
  Top Layer w0.254: v1(47.68,89.2) 46.41,89.2 45.65,88.44 45.65,66.68 v1(52.21,60.12) ; FPC1.15 v1(52.21,58.81)
  Bottom Layer w0.254: v1(52.21,58.81) v1(52.21,60.12) ; v1(47.68,89.2) 66.86,89.2 67.75,88.32 67.75,85.55 v1(67.72,85.52) 69.21,85.52 69.21,83.42 R17.2
ESP32_RX: length 20.9
  Bottom Layer w0.254: v1(71.05,69.66) 71.05,71.81 65.2,77.66 65.2,78.91 66.1,79.81 66.1,80.93 65.2,81.83 65.2,82.97 66.1,83.87 66.1,84.76 65.2,85.66 v1(65.2,86.67)
ESP32_TX: length 20.9
  Bottom Layer w0.254: v1(69.78,69.65) 69.78,71.68 64.32,77.14 64.32,87.06 v1(65.2,87.94)
ESP32_UART1_RX: length 79.5
  Top Layer w0.254: v1(57.08,33.96) 57.08,32.72 U7.16
  Bottom Layer w0.254: H5.2 46.16,81.86 v1(47.7,80.32) 56.7,80.32 62.42,74.6 62.42,38.41 57.97,33.96 v1(57.08,33.96)
ESP32_UART1_TX: length 80.3
  Top Layer w0.254: U7.17 53.72,34.66 54.16,35.1 v1(57.08,35.1)
  Bottom Layer w0.254: v1(57.08,35.1) 58.1,35.1 61.53,38.53 61.53,74.09 56.57,79.05 47.7,79.05 v1(47.7,79.05) 45.27,81.48 45.27,93.9 H5.1
ESP32_USB_D+: length 51.5
  Top Layer w0.254: D2.3 v1(71.37,16.05)
  Bottom Layer w0.254: v1(71.37,16.05) 71.37,53.33 71.69,53.64 71.69,61.14 v1(68.51,64.31)
ESP32_USB_D+_IN: length 8.9
  Top Layer w0.254: USB2.A6 71.44,8.44 71.69,8.69 ; 71.69,8.69 70.29,8.69 69.91,9.07 69.91,9.58 70.31,9.97 71.12,9.97 71.37,10.23 D2.4 ; 71.69,8.69 72.19,8.69 72.45,8.43 72.45,7.56 USB2.B6
ESP32_USB_D-: length 51.5
  Top Layer w0.254: D2.1 73.34,14.35 v1(73.34,16.05)
  Bottom Layer w0.254: v1(73.34,16.05) 73.34,60.74 v1(69.78,64.3)
ESP32_USB_D-_IN: length 9.3
  Top Layer w0.254: USB2.B7 70.94,6.39 71.18,6.15 71.69,6.15 ; USB2.A7 v1(71.94,6.41) ; D2.6 73.27,10.91 v1(71.94,9.58)
  Bottom Layer w0.254: v1(71.94,9.58) 71.94,9.57 v1(71.94,6.41)
FULL: length 4.9
  Top Layer w0.254: TP4056X1.6 88.2,74.6 88.58,74.22 88.58,72.06 88.2,71.68 R27.1
GPS_RX: length 44.1
  Top Layer w0.254: H9.2 16.11,31.8 20.38,31.8 23.51,28.67 CN7.3 23.55,25 23.55,19.74 24.57,18.72 45.78,18.72 47.22,20.16 U7.51
GPS_TX: length 43.8
  Top Layer w0.254: H9.1 21.09,29.31 22.41,27.99 22.41,25.05 22.41,25.04 22.41,19.61 23.81,18.21 46.03,18.21 47.72,19.9 U7.52
ICM42688P_CS: length 11.9
  Top Layer w0.254: ICM42688P1.12 54.28,41.32 v1(54.92,41.96) ; v1(52.64,34.98) 52.22,34.56 U7.20
  Bottom Layer w0.254: 55.54,42.71 55.54,42.58 v1(54.92,41.96) 52.64,39.67 v1(52.64,34.98)
ICM42688P_IRQ: length 7.7
  Top Layer w0.254: ICM42688P1.4 51.12,39.31 50.22,38.41 50.22,33.36 U7.24
ICM42688P_MISO: length 13
  Top Layer w0.254: U7.22 51.24,33.38 51.24,36.12 v1(51.49,36.37) ; ICM42688P1.1 v1(52.52,41.98)
  Bottom Layer w0.254: v1(51.49,36.37) 50.86,37.01 50.86,40.32 v1(52.52,41.98) 52.52,42.91 TP1.1 52.51,42.95 R4.2
ICM42688P_MOSI: length 13.5
  Top Layer w0.254: U7.23 50.73,33.37 50.73,36.63 v1(51.49,37.39) ; ICM42688P1.14 v1(53.28,42.34)
  Bottom Layer w0.254: R5.2 54.16,43.84 TP2.1 53.51,42.57 v1(53.28,42.34) 53.28,41.84 51.49,40.06 v1(51.49,37.39)
ICM42688P_SCK: length 13.8
  Top Layer w0.254: ICM42688P1.13 53.78,41.83 v1(54.16,42.22) ; U7.21 51.72,35.15 v1(52.05,35.48)
  Bottom Layer w0.254: v1(52.05,35.48) 52.08,35.51 52.08,40 54.16,42.09 v1(54.16,42.22) 54.16,42.48 R6.2
LCD_CS: length 27.9
  Top Layer w0.254: FPC1.9 55.21,54.7 v1(55.3,54.79)
  Bottom Layer w0.254: v1(55.3,54.79) 55.3,71.93 v1(53.27,73.96)
LCD_DC: length 28
  Top Layer w0.254: v1(54.19,56.79) 54.21,56.77 FPC1.11
  Bottom Layer w0.254: v1(52,73.96) 54.19,71.77 v1(54.19,56.79)
LCD_LED: length 30.6
  Top Layer w0.254: v1(57.84,59.49) 48.75,59.49 v1(43.95,54.69)
  Bottom Layer w0.254: v1(58.35,73.96) 57.84,73.45 v1(57.84,59.49)
LCD_SCK: length 28.7
  Top Layer w0.254: FPC1.10 54.71,55.21 55.68,56.19 v1(56.57,56.19)
  Bottom Layer w0.254: v1(55.81,73.96) 56.57,73.2 v1(56.57,56.19)
LCD_SDA: length 29.7
  Top Layer w0.254: v1(55.94,57.96) 54.41,57.96 53.21,56.76 FPC1.13
  Bottom Layer w0.254: v1(54.54,73.96) 55.94,72.56 v1(55.94,57.96)
LCD_SDO: length 31
  Top Layer w0.254: FPC1.14 52.71,57.66 53.78,58.72 v1(57.21,58.72)
  Bottom Layer w0.254: v1(57.21,58.72) 57.21,73.83 v1(57.08,73.96)
LEFT_BT_1: length 55.7
  Top Layer w0.254: H4.2 4.5,4.12 18.09,17.7 46.54,17.7 49.22,20.38 U7.55
LEFT_BT_2: length 54.8
  Top Layer w0.254: U7.56 49.72,20.12 46.79,17.2 18.47,17.2 7.04,5.77 H4.3
LEFT_BT_3: length 53.9
  Top Layer w0.254: U7.57 50.22,19.86 47.05,16.69 18.85,16.69 9.58,7.42 H4.4
LEFT_BT_4: length 53
  Top Layer w0.254: H4.5 12.12,9.19 19.11,16.18 47.3,16.18 50.72,19.6 U7.58
LEFT_CT_H: length 60.2
  Top Layer w0.254: v1(48.57,34.85) 48.72,34.7 U7.27 ; v1(33.64,54.53) v1(35.49,54.53)
  Bottom Layer w0.254: v1(48.57,34.85) 37.9,34.85 35.49,37.26 v1(35.49,54.53) ; CN2.2 22.03,39.55 23.3,40.82 23.3,50.6 27.24,54.53 v1(33.64,54.53)
LEFT_CT_V: length 55.3
  Top Layer w0.254: U7.26 49.22,35.24 v1(49.46,35.48) ; v1(36.25,55.42) v1(33.63,55.42)
  Bottom Layer w0.254: v1(36.25,55.42) 36.25,37.64 38.41,35.48 v1(49.46,35.48) ; v1(33.63,55.42) 26.86,55.42 22.41,50.98 22.41,48.18 21.39,47.17 CN1.2
LORA_RX: length 78.4
  Top Layer w0.254: H8.1 36.43,27.23 v1(42.22,27.23) 42.59,26.86 U7.42
  Bottom Layer w0.254: v1(42.22,27.23) 39.43,27.23 34.86,31.8 34.86,75.74 38.16,79.05 38.16,83.3 v1(42.34,87.49)
LORA_TX: length 76.5
  Top Layer w0.254: H8.2 34.76,26.36 v1(41.99,26.36) U7.43
  Bottom Layer w0.254: v1(41.99,26.36) 41.97,26.34 39.43,26.34 34.22,31.55 34.22,77.14 26.87,84.49 v1(25.84,84.49)
M0: length 6.7
  Top Layer w0.254: H6.2 21.14,79.43 25.28,79.43 25.84,79.99
M1: length 3.7
  Top Layer w0.254: 25.84,76.99 24.68,78.16 H7.2
NRST: length 17.7
  Top Layer w0.254: U7.7 57.73,26.86 v1(58.61,27.74)
  Bottom Layer w0.254: R21.2 64.71,36.43 C29.1 64.76,35.06 v1(63.28,33.58) 61.02,33.58 58.61,31.17 v1(58.61,27.74)
OSC8_IN: length 10.2
  Top Layer w0.254: X2.2 63.2,24.04 R10.2 61.71,25.13 C19.2 59.15,25.86 U7.5
OSC8_OUT: length 10.1
  Top Layer w0.254: X2.1 63.2,28.14 R10.1 61.71,27.04 C18.2 59.2,26.36 U7.6
QMC5883P_SCL: length 8.4
  Top Layer w0.254: QMC5883P1.1 47.64,39.2 48.42,38.43 v1(48.42,37.92) 47.72,37.22 U7.29
  Bottom Layer w0.254: TP5.1 47.16,37.92 v1(48.42,37.92)
QMC5883P_SDA: length 7.4
  Top Layer w0.254: QMC5883P1.16 46.5,36.9 v1(46,36.4) 47.22,35.17 U7.30
  Bottom Layer w0.254: TP6.1 46,37.71 v1(46,36.4)
RF_IN: length 2.3
  Top Layer w0.335: 29.01,34.75 29.01,36.98 R29.1
RIGHT_BT_1: length 52.8
  Top Layer w0.254: U7.2 57.03,24.36 58.61,22.78 58.61,19.86 60.26,18.21 81.72,18.21 95.44,4.5 H3.2
RIGHT_BT_2: length 53.2
  Top Layer w0.254: U7.62 52.72,19.15 54.16,17.7 81.47,17.7 92.9,6.27 H3.3
RIGHT_BT_3: length 52.3
  Top Layer w0.254: U7.61 52.22,18.88 53.91,17.2 81.21,17.2 90.36,8.05 H3.4
RIGHT_BT_4: length 51.7
  Top Layer w0.254: U7.59 51.22,19.12 53.65,16.69 80.96,16.69 87.82,9.83 H3.5
RIGHT_CT_H: length 31.5
  Top Layer w0.254: CN3.2 64.96,39.55 59.62,34.21 59.62,29.9 57.09,27.36 U7.8
RIGHT_CT_V: length 34.5
  Top Layer w0.254: CN4.2 71.69,47.04 59.24,34.59 59.24,30.15 56.95,27.86 U7.9
SIDE_BT_1: length 84.3
  Top Layer w0.254: H2.2 93.66,90.98 92.39,89.71 92.39,69.27 91.37,68.25 88.2,68.25 87.56,67.61 87.56,57.96 84.89,55.3 79.18,55.3 58.86,34.98 58.86,30.4 56.82,28.36 U7.10
SIDE_BT_2: length 86.2
  Top Layer w0.254: H2.3 91.88,91.62 91.88,69.39 91.24,68.76 88.07,68.76 87.05,67.74 87.05,58.22 84.64,55.8 78.93,55.8 58.48,35.36 58.48,30.66 56.68,28.86 U7.11
SIDE_BT_3: length 80
  Top Layer w0.254: H1.3 9.46,90.53 9.46,83.94 27.11,66.28 27.11,60.24 35.87,51.47 35.87,36.12 40.63,31.36 U7.33
SIDE_BT_4: length 78.2
  Top Layer w0.254: H1.2 8.95,88.5 8.95,83.62 26.6,65.96 26.6,60 35.36,51.23 35.36,35.74 40.24,30.86 U7.34
STM32_USB_DM: length 18.2
  Top Layer w0.254: D1.3 v1(33.91,15.16) ; U7.44 42.63,25.86 41.97,25.2 v1(40.83,25.2)
  Bottom Layer w0.254: v1(33.91,15.16) 35.11,16.37 35.11,20.5 39.81,25.2 v1(40.83,25.2)
STM32_USB_DM_IN: length 9.8
  Top Layer w0.254: D1.4 33.91,11.42 33.08,10.59 32.49,10.59 v1(31.58,9.68) ; USB1.B7 30.55,6.53 30.74,6.34 31.37,6.34 v1(31.55,6.53) 31.55,7.54 USB1.A7
  Bottom Layer w0.254: v1(31.58,9.68) 31.58,6.55 v1(31.55,6.53)
STM32_USB_DP: length 18.1
  Top Layer w0.254: U7.45 42.89,25.36 41.97,24.44 v1(40.83,24.44) ; D1.1 35.87,14.22 v1(35.87,15.16)
  Bottom Layer w0.254: v1(40.83,24.44) 39.94,24.44 39.43,23.93 39.43,23.04 39.05,22.66 38.16,22.66 37.79,22.29 37.79,21.4 37.4,21.01 36.51,21.01 35.87,20.37 35.87,19.26 36.38,18.76 36.38,17.56 35.87,17.05 v1(35.87,15.16)
STM32_USB_DP_IN: length 9.2
  Top Layer w0.254: USB1.A6 31.05,8.44 31.3,8.69 31.81,8.69 32.05,8.44 ; 32.05,8.44 USB1.B6 ; 32.05,8.44 32.05,9.32 32.81,10.08 34.98,10.08 35.81,10.91 D1.6
SWCLK: length 19.5
  Top Layer w0.254: U7.49 46.22,20.56 45.14,19.48 v1(43.37,19.48)
  Bottom Layer w0.254: U5.2 43.37,7.56 43.37,13.26 43.62,13.51 44.13,13.51 44.38,13.77 44.38,14.15 44.13,14.4 43.57,14.4 43.37,14.61 43.37,15.16 43.62,15.42 44.13,15.42 44.38,15.67 44.38,16.05 44.13,16.31 43.62,16.31 43.37,16.56 v1(43.37,19.48)
SWDIO: length 19.4
  Top Layer w0.254: v1(40.95,19.48) 40.95,22.78 43.03,24.86 U7.46
  Bottom Layer w0.254: U5.1 40.95,7.61 v1(40.95,19.48)
TRIGGER_1: length 42.7
  Top Layer w0.254: CN10.1 23.69,58.72 27.24,58.72 34.86,51.11 34.86,35.48 39.98,30.36 U7.35
TRIGGER_2: length 48.6
  Top Layer w0.254: CN13.1 17.28,57.01 28.32,57.01 34.27,51.06 34.27,35.31 39.72,29.86 U7.36
TRIGGER_3: length 45.8
  Top Layer w0.254: v1(70.29,54.66) v1(74.1,54.66) ; v1(57.84,24.56) 57.55,24.86 U7.3
  Bottom Layer w0.254: CN11.1 75.76,56.32 v1(74.1,54.66) ; v1(70.29,54.66) 63.05,47.42 63.05,37.9 57.08,31.93 57.08,25.32 v1(57.84,24.56)
TRIGGER_4: length 51.1
  Top Layer w0.254: v1(74.1,53.77) 74.05,53.82 v1(70.29,53.82) ; U7.4 58.32,25.36 v1(58.48,25.2)
  Bottom Layer w0.254: v1(74.1,53.77) 79.31,53.77 81.98,56.45 CN12.1 ; v1(58.48,25.2) 57.84,25.83 57.84,31.55 63.69,37.39 63.69,47.22 v1(70.29,53.82)
VUSB: length 19.2
  Top Layer w0.254: USB2.A9 74.03,7.76 74.03,12.7 73.59,13.13 72.7,13.13 72.32,12.75 D2.5 ; D1.5 34.86,12.24 34.22,12.88 30.28,12.88 28.89,11.48 28.89,7.71 USB1.B9
  vias: v1(28.89,7.92) v1(28.9,7.15) v1(33.7,7.95) v1(33.7,7.16) v1(69.29,7.94) v1(69.29,7.21) v1(74.09,7.97) v1(74.09,7.23) v1(81.15,71.93) v1(81.15,70.28) v1(81.34,73.33) v1(83.37,29.13) v1(84.53,82.98) v1(85.8,69.78) v1(87.78,79.11) v1(87.78,77.14)
$1N5: length 3.9
  Bottom Layer w0.254: Q1.1 42.29,54.46 42.48,54.65 ; 42.48,54.65 R14.2 ; 42.48,54.65 R15.2
$1N7: length 3.2
  Top Layer w0.254: FPC1.34 FPC1.35 FPC1.36 41.71,46.9 41.71,49.07
  vias: v1(41.68,49.07)
$1N8: length 1.8
  Bottom Layer w0.254: 43.24,50.88 43.24,49.08 R13.1
$1N74: length 3.5
  Top Layer w0.254: USB2.B5 73.44,4.13 v1(73.46,4.11)
$1N75: length 3.4
  Top Layer w0.254: USB2.A5 v1(70.44,4.15)
$2N3: length 1.8
  Top Layer w0.254: R1.2 81.38,75.86 TP4056X1.2
$2N16:
  vias: v1(75.82,87.43) v1(75.88,85.4) v1(75.92,83.49) v1(77.34,83.82) v1(77.34,83.08)
$2N18:
  vias: v1(75.75,77.9) v1(75.75,77.14) v1(76.72,77.9) v1(76.72,77.14) v1(79.25,81.2) v1(79.24,80.46)
$2N32:
  vias: v1(87.78,81.02) v1(87.8,82.98)
$2N33: length 3.5
  Top Layer w0.254: U2.4 79.01,83.39 77.34,81.71 v1(77.34,80.8)
  vias: v1(69.77,58.85)
$2N36: length 2
  Top Layer w0.254: R26.2 90.49,77.87 CHRG1.1
$2N37: length 2.6
  Top Layer w0.254: R27.2 87.4,70.07 87.4,69.78
$3N20: length 1.7
  Top Layer w0.254: v1(42.83,40.21) 44.48,40.21 44.49,40.2
$3N33: length 4.9
  Top Layer w0.336: RF1.5 28.76,92.52 U6.29
$5N75: length 2.9
  Top Layer w0.254: v1(48.83,30.69) 48.22,31.3 U7.28
$5N79: length 3.2
  Top Layer w0.254: U7.60 51.72,22.82 50.23,24.31 v1(50.13,24.31)
$5N93: length 2.3
  Bottom Layer w0.254: R24.1 57.8,18.97 U8.2
$5N113: length 3.4
  Top Layer w0.254: USB1.B5 33.05,4.18 v1(33.08,4.15)
$5N114: length 3.5
  Top Layer w0.254: USB1.A5 30.05,4.12 v1(30.03,4.1)
$6N5: length 7.3
  Bottom Layer w0.254: v1(30.11,25.05) 27.67,27.49 R28.1 25.71,26.6 v1(25.71,25.05)
$6N9: length 3
  Top Layer w0.8: C13.1 26.87,24.99 CN7.6
$6N11: length 7.1
  Bottom Layer w0.254: v1(29.01,25.05) 29.01,24.12 30.35,22.78 30.28,22.72 C15.2 32.31,20.69 L2.2
$6N15: length 3.6
  Top Layer w0.254: 28.98,40.3 R20.2 ; 28.97,42.09 R19.1
  Top Layer w0.335: R29.2 28.98,40.3 ; R20.2 28.97,42.09
$6N18: length 3.7
  Top Layer w0.254: 29.01,45.44 R25.2 28.98,45.38
  Top Layer w0.335: R19.2 28.98,45.38 ; 29.01,45.44 U4.1
$6N21: length 1.8
  Bottom Layer w0.254: Q2.1 23.01,28.94 R31.2
$6N23: length 3.7
  Bottom Layer w0.254: 21.24,27.04 19.81,27.04 19.11,26.34 U9.1
$6N24: length 2.2
  Bottom Layer w0.254: U9.2 16.98,23.33 R30.2

## Copper pours and planes (outline as drawn; the poured copper is in the pictures)
+3.3V on Inner1: -4.01,103.68 103.18,103.68 103.18,-2.62 -4.01,-2.62
GND on Top Layer: -11.24,103.17 103.44,103.17 103.44,-8.08 -11.24,-8.08
GND on Bottom Layer: -9.59,104.44 100.39,104.44 100.39,-8.46 -9.59,-8.46
GND on Inner2: -6.55,101.65 100.9,101.65 100.9,-5.41 -6.55,-5.41
ADC_BAT on Inner2: 48.06,28.84 48.06,34.47 54.41,34.47 63.3,43.36 63.3,60.2 69.02,60.2 69.02,41.13 56.74,28.84
BAT+ on Inner1: 88.83,82.73 91.04,84.93 92.99,84.93 92.99,69.42 86.76,69.42 86.76,73.55 88.83,75.62
VUSB on Inner1: 80.32,84.25 86.55,84.25 86.55,13.58 80.32,13.58
VUSB on Inner1: 22.81,16.29 98.04,16.29 98.04,2.03 22.81,2.03
VUSB on Inner1: 86.42,81.08 88.58,79.58 88.58,75.61 86.43,73.46 86.42,73.46
$2N16 on Inner1: 74.99,88.44 78.29,88.44 78.29,82.45 74.99,82.45
$2N18 on Inner1: 72.83,82.48 80.15,82.48 80.15,75.76 72.83,75.76
$2N32 on Inner1: 86.67,81.08 86.67,84.42 85.15,84.42 85.15,90.6 86.16,91.62 89.47,91.62 90.61,90.47 90.61,84.89 88.58,82.86 88.58,79.69 88.06,80.06
$2N33 on Top Layer: 78.24,81.87 78.24,92.07 85.66,92.07 85.66,81.87
$2N33 on Inner2: 69.28,57.89 69.28,66.88 72.96,70.55 72.96,82.6 78.54,82.6 78.54,68.63 76.13,66.22 76.13,60.38 73.64,57.89

## Text on the board
Bottom Silkscreen Layer: - BAT + | CLOSE | OPEN | 26/1/20 | STM32_USB | ESP32_USB | ManbaController V1.0
Top Silkscreen Layer: 40 | 1 | +3.3V | GND | M0/M1 | GPS_TX | GPS_RX | DATA | LORA_RX | LORA_TX | TX | RX | B | C | A | ENCODER_2 | ESP32_BOOT | ESP32_RST | STM32_RST | ENCODER_1 | TRIGGER_1 | TRIGGER_2 | TRIGGER_3 | TRIGGER_4 | VUSB | RIGHT_CT_V | RIGHT_CT_H | LEFT_CT_H | LEFT_CT_V | SWDIO | SWCLK | DEBUG_RX | Y | X | 40P 2.8寸 SPI TFT
